# EAGLE schematic Schematic v38 (EAGLE 9.7.0)
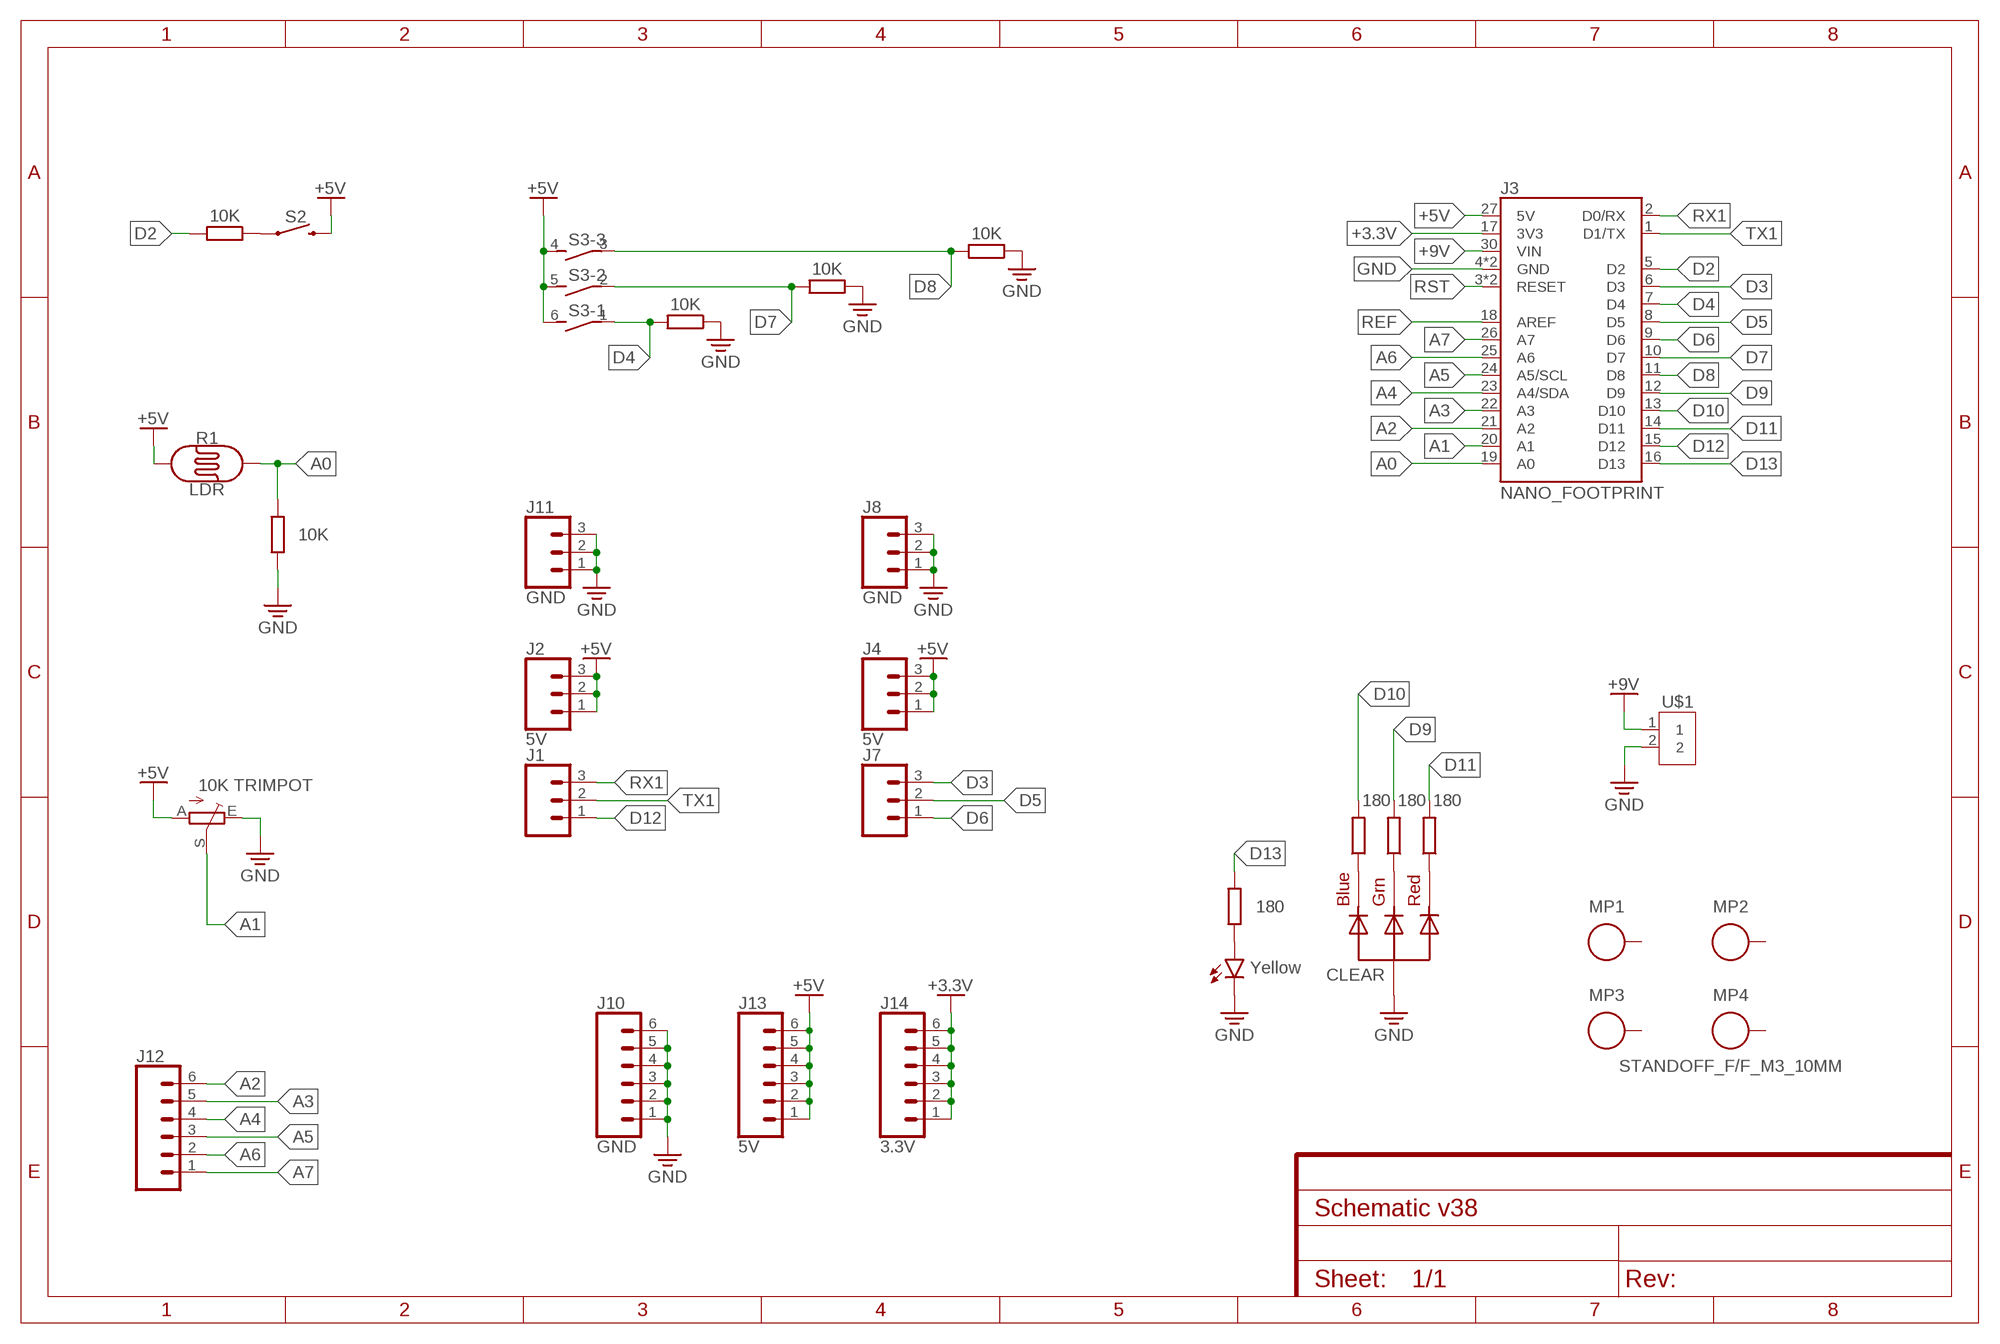
[diagram p0: schematic, sheet 1]

## Parts
CLEAR  RGBLED_CA-5MM  [LED5MMRGB]
D2  Yellow  LED5MM  [LED_5MM]
J1  CONN_03  [1X03]
J2  5V  CONN_03  [1X03]
J3  NANO_FOOTPRINT  [NANO]
J4  5V  CONN_03  [1X03]
J7  CONN_03  [1X03]
J8  GND  CONN_03  [1X03]
J10  GND  CONN_06SILK_FEMALE_PTH  [1X06]
J11  GND  CONN_03  [1X03]
J12  CONN_06SILK_FEMALE_PTH  [1X06]
J13  5V  CONN_06SILK_FEMALE_PTH  [1X06]
J14  3.3V  CONN_06SILK_FEMALE_PTH  [1X06]
MP1  STANDOFF_F/F_M3_10MM  [STANDOFF_HEX_FEMALE_550X1000_M3X0.5_MTGP850H320]
MP2  STANDOFF_F/F_M3_10MM  [STANDOFF_HEX_FEMALE_550X1000_M3X0.5_MTGP850H320]
MP3  STANDOFF_F/F_M3_10MM  [STANDOFF_HEX_FEMALE_550X1000_M3X0.5_MTGP850H320]
MP4  STANDOFF_F/F_M3_10MM  [STANDOFF_HEX_FEMALE_550X1000_M3X0.5_MTGP850H320]
R1  LDR  PHOTOCELLPTH-KIT  [PHOTOCELL-KIT]
R3  180  R_AXIAL-7.2MM-PITCH  [RESAD724W46L381D178B]
R4  10K TRIMPOT  TRIM_EU-B25P  [B25P]
R5  10K  R_AXIAL-7.2MM-PITCH  [RESAD724W46L381D178B]
R6  180  R_AXIAL-7.2MM-PITCH  [RESAD724W46L381D178B]
R7  180  R_AXIAL-7.2MM-PITCH  [RESAD724W46L381D178B]
R8  180  R_AXIAL-7.2MM-PITCH  [RESAD724W46L381D178B]
R9  10K  R_AXIAL-7.2MM-PITCH  [RESAD724W46L381D178B]
R10  10K  R_AXIAL-7.2MM-PITCH  [RESAD724W46L381D178B]
R11  10K  R_AXIAL-7.2MM-PITCH  [RESAD724W46L381D178B]
R12  10K  R_AXIAL-7.2MM-PITCH  [RESAD724W46L381D178B]
S2  BUTTON  MOMENTARY-SWITCH-SPST-PTH-6.0MM-KIT  [TACTILE_SWITCH_PTH_6.0MM_KIT]
S3  DIP SWITCH  DS03E  [DS-03]
U$1  2828XX-2282837-2  [TERMBLK_508-2N]

## Nets
+3.3V: J3.17(3V3) J14.1 J14.2 J14.3 J14.4 J14.5 J14.6
+5V: J2.1 J2.2 J2.3 J3.27(5V) J4.1 J4.2 J4.3 J13.1 J13.2 J13.3 J13.4 J13.5 J13.6 R1.1 R4.A S2.3 S3.4 S3.5 S3.6
+9V: J3.30(VIN) U$1.1
A0: J3.19(A0) R1.2 R9.2
A1: J3.20(A1) R4.S
A2: J3.21(A2) J12.6
A3: J3.22(A3) J12.5
A4: J3.23(A4/SDA) J12.4
A5: J3.24(A5/SCL) J12.3
A6: J3.25(A6) J12.2
A7: J3.26(A7) J12.1
D2: J3.5(D2) R5.2
D3: J3.6(D3) J7.3
D4: J3.7(D4) R12.2 S3.1
D5: J3.8(D5) J7.2
D6: J3.9(D6) J7.1
D7: J3.10(D7) R11.2 S3.2
D8: J3.11(D8) R10.2 S3.3
D9: J3.12(D9) R6.2
D10: J3.13(D10) R7.2
D11: J3.14(D11) R8.2
D12: J1.1 J3.15(D12)
D13: J3.16(D13) R3.2
GND: CLEAR.2(VCC) D2.K(C) J3.4(GND) J3.29(GND) J8.1 J8.2 J8.3 J10.1 J10.2 J10.3 J10.4 J10.5 J10.6 J11.1 J11.2 J11.3 R4.E R9.1 R10.1 R11.1 R12.1 U$1.2
N$1: D2.A R3.1
N$2: CLEAR.4(BLUE) R7.1
N$4: R5.1 S2.1
N$7: CLEAR.3(GREEN) R6.1
N$8: CLEAR.1(RED) R8.1
REF: J3.18(AREF)
RST: J3.3(RESET) J3.28(RESET)
RX1: J1.3 J3.2(D0/RX)
TX1: J1.2 J3.1(D1/TX)
Unconnected: MP1.1 MP2.1 MP3.1 MP4.1

## Library data of the parts
CLEAR = adafruit:RGBLED_CA: RGB LED, common-anode 5MM Staggered pins 5mm Piranha package http://www.ladyada.net/library/pcb/eaglelibrary.html
D2 = SparkFun-LED:LED: LED (Generic) Standard schematic elements and footprints for 5mm, 3mm, 1206, and 0603 sized LEDs. Generic LEDs with no color specified.
J1 J2 J4 J7 J8 J11 = SparkFun-Connectors:CONN_03: Multi connection point. Often used as Generic Header-pin footprint for 0.1 inch spaced/style header connections On any of the 0.1 inch spaced packages, you can populate with these: Break Away Headers - Straight <https://www.sparkfun.com/products/116> (PRT-00116) Break Away Male Headers - Right Angle <https://www.sparkfun.com/products/553> (PRT-00553) Female Headers <https://www.sparkfun.com/products/115> (PRT-00115) Break Away Headers - Machine Pin <https://www.sparkfun.com/products/117> (PRT-00117) Break Away Female Headers - Swiss Machine Pin <https://www.sparkfun.com/products/743> (PRT-00743) Stackable Header - 3 Pin (Female, 0.1") <https://www.sparkfun.com/products/13875> (PRT-13875) For SCREWTERMINALS and SPRING TERMINALS visit here: Screw Terimnals on SparkFun.com <https://www.sparkfun.com/search/results?term=Screw+Terminals> (5mm/3.5mm/2.54mm spacing) This device is also useful as a general connection point to wire up your design to another part of your project. Our various solder wires solder well into these plated through hole pads. Hook-Up Wire - Assortment (Stranded, 22 AWG) <https://www.sparkfun.com/products/11375> (PRT-11375) Hook-Up Wire - Assortment (Solid Core, 22 AWG) <https://www.sparkfun.com/products/11367> (PRT-11367) View the entire wire category on our website here <https://www.sparkfun.com/categories/141> Special notes: Molex polarized connector foot print use with SKU : PRT-08232 with associated crimp pins and housings.
J3 = SparkFun-Boards:NANO_FOOTPRINT: Generic Nano Footprint
J10 J12-J14 = SparkFun-Connectors:CONN_06: Multi connection point. Often used as Generic Header-pin footprint for 0.1 inch spaced/style header connections On any of the 0.1 inch spaced packages, you can populate with these: Break Away Headers - Straight <https://www.sparkfun.com/products/116> (PRT-00116) Break Away Male Headers - Right Angle <https://www.sparkfun.com/products/553> (PRT-00553) Female Headers <https://www.sparkfun.com/products/115> (PRT-00115) Break Away Headers - Machine Pin <https://www.sparkfun.com/products/117> (PRT-00117) Break Away Female Headers - Swiss Machine Pin <https://www.sparkfun.com/products/743> (PRT-00743) Arduino Stackable Header - 6 Pin <https://www.sparkfun.com/products/9280> (PRT-09280) For SCREWTERMINALS and SPRING TERMINALS visit here: Screw Terimnals on SparkFun.com <https://www.sparkfun.com/search/results?term=Screw+Terminals> (5mm/3.5mm/2.54mm spacing) This device is also useful as a general connection point to wire up your design to another part of your project. Our various solder wires solder well into these plated through hole pads. Hook-Up Wire - Assortment (Stranded, 22 AWG) <https://www.sparkfun.com/products/11375> (PRT-11375) Hook-Up Wire - Assortment (Solid Core, 22 AWG) <https://www.sparkfun.com/products/11367> (PRT-11367) View the entire wire category on our website here <https://www.sparkfun.com/categories/141>; PROD_ID: CONN-08437
MP1-MP4 = PCB-Fasteners_Hardware:STANDOFF_F/F: Female-Female Standoff/Spacer with Mounting pad and hole. Essentra : Female Standoff <https://www.essentracomponents.co.in/index.php?option=com_virtuemart&view=productdetails&virtuemart_product_id=14493> The hole and pad sizes may vary based on the application and type of hardware; always verify the Manufacturer specification or Global Standards.; CATEGORY: Standoff/Spacer; SUB-CATEGORY: Female-Female
R1 = SparkFun-Sensors:PHOTOCELL: Photocell (Photodetector, Photo Resistor, CdS) This is a very small light sensor. A photocell changes (also called a photodetector, photo resistor, CdS or photoconductive cell) resistance depending on the amount of light it is exposed to. These little sensors make great ambient light triggers (when light in the room turns on, do something). Datasheet <http://cdn.sparkfun.com/datasheets/Sensors/LightImaging/SEN-09088.pdf> SparkFun Products Mini Photocell <https://www.sparkfun.com/products/9088> (SEN-09088); PROD_ID: COMP-09129; SF_ID: SEN-09088
R3 R5-R12 = Resistor:R: Resistor Fixed - Generic; CATEGORY: Resistor; SUB-CATEGORY: Fixed
R4 = pot:TRIM_EU-: POTENTIOMETER
S2 = SparkFun-Switches:MOMENTARY-SWITCH-SPST: Momentary Switch (Pushbutton) - SPST Normally-open (NO) SPST momentary switches (buttons, pushbuttons). Variants PTH-12MM - 12mm square, through-hole Momentary Pushbutton Switch - 12mm Square <https://www.sparkfun.com/products/9190> (COM-09190) PTH-6.0MM, PTH-6.0MM-KIT - 6.0mm square, through-hole Mini Pushbutton Switch <https://www.sparkfun.com/products/97> (COM-00097) KIT package intended for soldering kit's - only one side of pads' copper is exposed. PTH-RIGHT-ANGLE-KIT - Right-angle, through-hole Right Angle Tactile Button <https://www.sparkfun.com/products/10791> - Used on SparkFun BigTime Watch Kit <https://www.sparkfun.com/products/11734> SMD-12MM - 12mm square, surface-mount Tactile Button - SMD (12mm) <https://www.sparkfun.com/products/12993> (COM-12993) Used on SparkFun PicoBoard <https://www.sparkfun.com/products/11888> SMD-4.5MM - 4.5mm Square Trackball Switch Used on SparkFun Blackberry Trackballer Breakout <https://www.sparkfun.com/products/13169> SMD-4.6MMX2.8MM - 4.60mm x 2.80mm, surface mount Used on SparkFun Pro Micro - RP2040 <https://www.sparkfun.com/products/17717> SMD-5.2MM, SMD-5.2-REDUNDANT - 5.2mm square, surface-mount Mini Pushbutton Switch - SMD <https://www.sparkfun.com/products/8720> (COM-08720) Used on Arduino Pro Mini <https://www.sparkfun.com/products/11114> REDUNDANT package connects both switch circuits together SMD-6.0X3.5MM - 6.0 x 3.5mm, surface mount Momentary Reset Switch SMD <https://www.sparkfun.com/products/8229> (COM-08229) SMD-6.2MM-TALL - 6.2mm square, surface mount Tactile Button - SMD (6mm) <https://www.sparkfun.com/products/12992> Used on SparkFun Digital Sandbox <https://www.sparkfun.com/products/12651> SMD-RIGHT-ANGLE - Right-angle, surface mount Used on SparkFun Block for Intel® Edison - Arduino <https://www.sparkfun.com/products/13036>; PROD_ID: SWCH-08441; SF_SKU: COM-00097
S3 = Switch:DS03E: DIL/CODE SWITCH; CATEGORY: SWITCH; TYPE: SPST
U$1 = Connector:2828XX-2: 2 Position Wire to Board Terminal Block Horizontal with Board Datasheet <https://www.te.com.cn/commerce/DocumentDelivery/DDEController?Action=showdoc&DocId=Catalog+Section%7F1308389_EUROSTYLE_TERMINAL_BLOCKS%7F0607%7Fpdf%7FEnglish%7FENG_CS_1308389_EUROSTYLE_TERMINAL_BLOCKS_0607.pdf%7F2-282837-5>; CATEGORY: Connector; DESCRIPTION: 2 Position Wire to Board Terminal Block Horizontal with Board 5.08 mm Through Hole; MANUFACTURER: TE Connectivity; MPN: 282837-2; OPERATING_TEMPERATURE: -40°C to +105°C; PART_STATUS: ACTIVE; ROHS_COMPLIANCE: RoHS Compliant; SERIES: 282837; SUBCATEGORY: Terminal Block; TYPE: Side Wire Entry